# Altium schematic sheet S9013-G.schdoc
size 49 x 30 mm
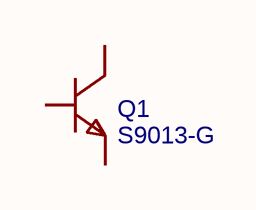
[diagram p0: S9013-G.schdoc]

## Parts
Q1  S9013-G  [SOT-23-3_L2.9-W1.3-P1.90-LS2.4-BR]

## Nets

Not connected (* = marked no-connect by the designer): Q1 1(B) 2(E) 3(C)

## Library data of the parts
Q1 = S9013-G: BOM_Manufacturer: Changjiang Electronics Tech (CJ); Contributor: LCSC; BOM_Supplier: LCSC; BOM_Supplier Part: C164888; BOM_Manufacturer Part: S9013-G; BOM_JLCPCB Part Class: Extended Part; spicePre: Q; spiceSymbolName: S9013-G